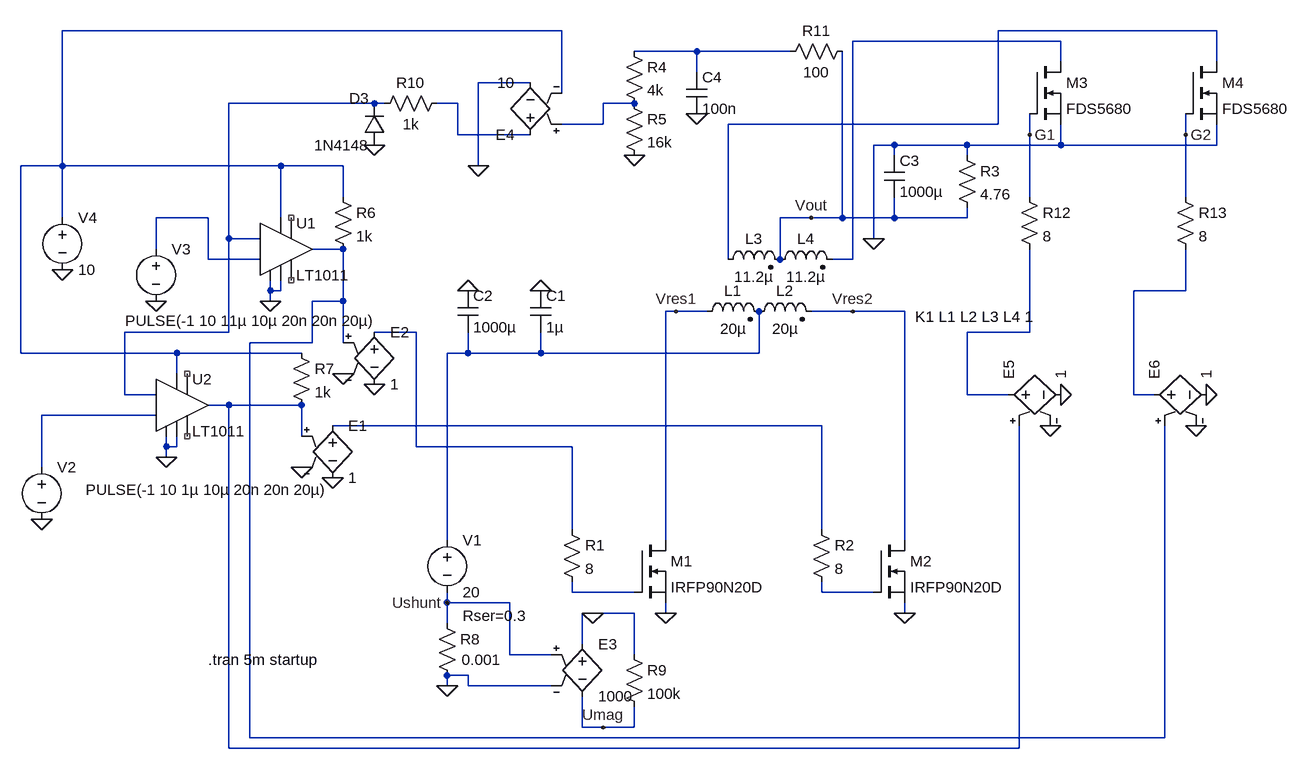
[diagram p0: schematic switcher_new_diodes2.asc]
switcher_new_diodes2.asc, the LTspice schematic file:
Version 4
SHEET 1 1648 680
WIRE 16 -640 -752 -640
WIRE 1024 -640 688 -640
WIRE 784 -624 464 -624
WIRE 224 -608 128 -608
WIRE 368 -608 224 -608
WIRE 784 -592 784 -624
WIRE 1024 -592 1024 -640
WIRE 224 -576 224 -608
WIRE -32 -560 -112 -560
WIRE 16 -544 16 -640
WIRE -272 -528 -496 -528
WIRE -256 -528 -272 -528
WIRE -144 -528 -176 -528
WIRE 128 -528 80 -528
WIRE 80 -496 80 -528
WIRE 80 -496 16 -496
WIRE 688 -496 688 -640
WIRE 688 -496 272 -496
WIRE -144 -480 -144 -528
WIRE -32 -480 -144 -480
WIRE 736 -480 736 -512
WIRE 976 -480 976 -512
WIRE 528 -464 496 -464
WIRE 640 -464 528 -464
WIRE 784 -464 784 -496
WIRE 784 -464 640 -464
WIRE 1024 -464 1024 -496
WIRE 1024 -464 784 -464
WIRE 528 -448 528 -464
WIRE 640 -448 640 -464
WIRE -752 -432 -752 -640
WIRE -752 -432 -816 -432
WIRE -416 -432 -752 -432
WIRE -320 -432 -416 -432
WIRE -112 -432 -112 -560
WIRE -320 -384 -320 -432
WIRE 736 -384 736 -480
WIRE 976 -384 976 -480
WIRE -752 -352 -752 -432
WIRE -528 -352 -608 -352
WIRE -416 -352 -416 -432
WIRE 400 -352 352 -352
WIRE 448 -352 448 -608
WIRE 448 -352 400 -352
WIRE 528 -352 528 -384
WIRE 528 -352 448 -352
WIRE 640 -352 640 -368
WIRE 640 -352 528 -352
WIRE -496 -320 -496 -528
WIRE -448 -320 -496 -320
WIRE 496 -320 496 -464
WIRE -608 -304 -608 -352
WIRE -320 -304 -368 -304
WIRE -528 -288 -528 -352
WIRE -448 -288 -528 -288
WIRE 272 -288 272 -496
WIRE 352 -288 352 -352
WIRE 464 -288 464 -624
WIRE 464 -288 432 -288
WIRE -432 -240 -432 -256
WIRE -416 -240 -416 -256
WIRE -416 -240 -432 -240
WIRE 976 -240 976 -304
WIRE 976 -240 896 -240
WIRE -432 -224 -432 -240
WIRE -320 -224 -320 -304
WIRE -320 -224 -368 -224
WIRE 192 -208 176 -208
WIRE 240 -208 192 -208
WIRE 464 -208 400 -208
WIRE 544 -208 464 -208
WIRE -496 -176 -496 -320
WIRE -496 -176 -656 -176
WIRE -208 -176 -272 -176
WIRE 736 -176 736 -304
WIRE 736 -176 640 -176
WIRE -368 -160 -368 -224
WIRE -368 -160 -464 -160
WIRE -320 -160 -320 -224
WIRE -816 -144 -816 -432
WIRE -576 -144 -816 -144
WIRE -384 -144 -576 -144
WIRE -128 -144 -128 -176
WIRE -128 -144 -160 -144
WIRE -16 -144 -16 -176
WIRE -16 -144 -128 -144
WIRE 320 -144 320 -208
WIRE 320 -144 -16 -144
WIRE -576 -112 -576 -144
WIRE -656 -80 -656 -176
WIRE -608 -80 -656 -80
WIRE 640 -80 640 -176
WIRE 704 -80 640 -80
WIRE 896 -80 896 -240
WIRE 928 -80 896 -80
WIRE -496 -64 -528 -64
WIRE -384 -64 -496 -64
WIRE -608 -48 -784 -48
WIRE 416 -32 -336 -32
WIRE -384 -16 -384 -64
WIRE -592 0 -592 -16
WIRE -576 0 -576 -16
WIRE -576 0 -592 0
WIRE -208 0 -208 -176
WIRE 32 0 -208 0
WIRE -592 16 -592 0
WIRE -784 32 -784 -48
WIRE 32 128 32 0
WIRE 416 128 416 -32
WIRE -160 144 -160 -144
WIRE 176 144 176 -208
WIRE 544 144 544 -208
WIRE 32 224 32 208
WIRE 128 224 32 224
WIRE 416 224 416 208
WIRE 496 224 416 224
WIRE -160 240 -160 224
WIRE -64 240 -160 240
WIRE 64 256 48 256
WIRE 128 256 64 256
WIRE 176 256 176 240
WIRE 544 256 544 240
WIRE -160 272 -160 240
WIRE 48 304 48 256
WIRE -64 320 -64 240
WIRE 0 320 -64 320
WIRE 128 320 128 256
WIRE -128 352 -160 352
WIRE -160 368 -160 352
WIRE -128 368 -128 352
WIRE 0 368 -128 368
WIRE 48 432 48 384
WIRE 80 432 48 432
WIRE 128 432 128 400
WIRE 128 432 80 432
WIRE -464 448 -464 -160
WIRE 944 448 944 -32
WIRE 944 448 -464 448
WIRE -496 464 -496 -64
WIRE 720 464 720 -32
WIRE 720 464 -496 464
FLAG 192 -208 Vres1
FLAG 464 -208 Vres2
FLAG -784 112 0
FLAG 496 -320 0
FLAG -16 -240 0
FLAG -128 -240 0
FLAG -608 -224 0
FLAG -432 -224 0
FLAG -752 -272 0
FLAG -592 16 0
FLAG 128 -448 0
FLAG -336 48 0
FLAG -384 32 0
FLAG -272 -96 0
FLAG -320 -112 0
FLAG -160 368 0
FLAG -160 240 Ushunt
FLAG 64 256 0
FLAG 80 432 Umag
FLAG -112 -432 0
FLAG -272 -464 0
FLAG 224 -512 0
FLAG 176 256 0
FLAG 544 256 0
FLAG 736 -480 G1
FLAG 976 -480 G2
FLAG 400 -352 Vout
FLAG 1008 -80 0
FLAG 784 -80 0
FLAG 768 -32 0
FLAG 992 -32 0
SYMBOL nmos 128 144 R0
SYMATTR InstName M1
SYMATTR Value IRFP90N20D
SYMBOL nmos 496 144 R0
SYMATTR InstName M2
SYMATTR Value IRFP90N20D
SYMBOL voltage -160 128 R0
WINDOW 123 0 0 Left 0
WINDOW 39 24 132 Left 0
SYMATTR SpiceLine Rser=0.3
SYMATTR InstName V1
SYMATTR Value 20
SYMBOL res 16 112 R0
SYMATTR InstName R1
SYMATTR Value 8
SYMBOL res 400 112 R0
SYMATTR InstName R2
SYMATTR Value 8
SYMBOL ind2 224 -192 R270
WINDOW 0 32 56 VTop 0
WINDOW 3 5 56 VBottom 0
SYMATTR InstName L1
SYMATTR Value 20µ
SYMATTR Type ind
SYMATTR SpiceLine Rser=0.1
SYMBOL ind2 304 -192 R270
WINDOW 0 32 56 VTop 0
WINDOW 3 5 56 VBottom 0
SYMATTR InstName L2
SYMATTR Value 20µ
SYMATTR Type ind
SYMATTR SpiceLine Rser=0.1
SYMBOL ind2 256 -272 R270
WINDOW 0 32 56 VTop 0
WINDOW 3 5 56 VBottom 0
SYMATTR InstName L3
SYMATTR Value 11.2µ
SYMATTR Type ind
SYMATTR SpiceLine Rser=0.01
SYMBOL voltage -784 16 R0
WINDOW 3 68 50 Left 0
WINDOW 123 0 0 Left 0
WINDOW 39 0 0 Left 0
SYMATTR Value PULSE(-1 10 1µ 10µ 20n 20n 20µ)
SYMATTR InstName V2
SYMBOL ind2 336 -272 R270
WINDOW 0 32 56 VTop 0
WINDOW 3 5 56 VBottom 0
SYMATTR InstName L4
SYMATTR Value 11.2µ
SYMATTR Type ind
SYMATTR SpiceLine Rser=0.01
SYMBOL cap 512 -448 R0
SYMATTR InstName C3
SYMATTR Value 1000µ
SYMATTR SpiceLine Rser=0.03
SYMBOL res 624 -464 R0
SYMATTR InstName R3
SYMATTR Value 4.76
SYMBOL cap -32 -240 R0
SYMATTR InstName C1
SYMATTR Value 1µ
SYMATTR SpiceLine Rser=0.001 Lser=10n
SYMBOL cap -144 -240 R0
SYMATTR InstName C2
SYMATTR Value 1000µ
SYMATTR SpiceLine Rser=0.03
SYMBOL voltage -608 -320 R0
WINDOW 3 -47 126 Left 0
WINDOW 123 0 0 Left 0
WINDOW 39 0 0 Left 0
SYMATTR Value PULSE(-1 10 11µ 10µ 20n 20n 20µ)
SYMATTR InstName V3
SYMBOL Comparators\\LT1011 -416 -304 R0
SYMATTR InstName U1
SYMBOL voltage -752 -368 R0
WINDOW 123 0 0 Left 0
WINDOW 39 0 0 Left 0
SYMATTR InstName V4
SYMATTR Value 10
SYMBOL Comparators\\LT1011 -576 -64 R0
SYMATTR InstName U2
SYMBOL res 112 -624 R0
SYMATTR InstName R4
SYMATTR Value 4k
SYMBOL res 112 -544 R0
SYMATTR InstName R5
SYMATTR Value 16k
SYMBOL e -336 -48 R0
SYMATTR InstName E1
SYMATTR Value 1
SYMBOL e -272 -192 R0
SYMATTR InstName E2
SYMATTR Value 1
SYMBOL res -336 -400 R0
SYMATTR InstName R6
SYMATTR Value 1k
SYMBOL res -400 -160 R0
SYMATTR InstName R7
SYMATTR Value 1k
SYMBOL res -176 256 R0
WINDOW 3 38 72 Left 0
SYMATTR Value 0.001
SYMATTR InstName R8
SYMBOL e 48 288 R0
SYMATTR InstName E3
SYMATTR Value 1000
SYMBOL res 112 304 R0
SYMATTR InstName R9
SYMATTR Value 100k
SYMBOL e -32 -464 R180
SYMATTR InstName E4
SYMATTR Value 10
SYMBOL diode -256 -464 R180
WINDOW 0 24 72 Left 0
WINDOW 3 24 0 Left 0
SYMATTR InstName D3
SYMATTR Value 1N4148
SYMBOL res -160 -544 R90
WINDOW 0 0 56 VBottom 0
WINDOW 3 32 56 VTop 0
SYMATTR InstName R10
SYMATTR Value 1k
SYMBOL cap 208 -576 R0
SYMATTR InstName C4
SYMATTR Value 100n
SYMATTR SpiceLine Rser=0.001 Lser=10n
SYMBOL res 464 -624 R90
WINDOW 0 0 56 VBottom 0
WINDOW 3 32 56 VTop 0
SYMATTR InstName R11
SYMATTR Value 100
SYMBOL nmos 736 -592 R0
SYMATTR InstName M3
SYMATTR Value FDS5680
SYMBOL nmos 976 -592 R0
SYMATTR InstName M4
SYMATTR Value FDS5680
SYMBOL e 688 -80 R270
SYMATTR InstName E5
SYMATTR Value 1
SYMBOL e 912 -80 R270
SYMATTR InstName E6
SYMATTR Value 1
SYMBOL res 720 -400 R0
SYMATTR InstName R12
SYMATTR Value 8
SYMBOL res 960 -400 R0
SYMATTR InstName R13
SYMATTR Value 8
TEXT 560 -200 Left 0 !K1 L1 L2 L3 L4 1
TEXT -528 328 Left 0 !.tran 5m startup

The netlist it stands for:
* switcher_new_diodes2.asc
M1 Vres1 N017 0 0 IRFP90N20D
M2 Vres2 N018 0 0 IRFP90N20D
V1 N013 Ushunt 20 Rser=0.3
R1 N011 N017 8
R2 N016 N018 8
L1 Vres1 N013 20µ Rser=0.1
L2 N013 Vres2 20µ Rser=0.1
L3 N002 Vout 11.2µ Rser=0.01
V2 N015 0 PULSE(-1 10 1µ 10µ 20n 20n 20µ)
L4 Vout N003 11.2µ Rser=0.01
C3 0 Vout 1000µ Rser=0.03
R3 0 Vout 4.76
C1 0 N013 1µ Rser=0.001 Lser=10n
C2 0 N013 1000µ Rser=0.03
V3 N008 0 PULSE(-1 10 11µ 10µ 20n 20n 20µ)
XU1 0 N008 N005 0 NC_01 NC_02 N009 N001 LT1011
V4 N001 0 10
XU2 0 N015 N005 0 NC_03 NC_04 N014 N001 LT1011
R4 N004 N007 4k
R5 N007 0 16k
E1 N016 0 N014 0 1
E2 N011 0 N009 0 1
R6 N001 N009 1k
R7 N001 N014 1k
R8 Ushunt 0 0.001
E3 0 Umag Ushunt 0 1000
R9 0 Umag 100k
E4 N006 0 N007 N001 10
D3 0 N005 1N4148
R10 N006 N005 1k
C4 N004 0 100n Rser=0.001 Lser=10n
R11 Vout N004 100
M3 N003 G1 0 0 FDS5680
M4 N002 G2 0 0 FDS5680
E5 N012 0 N014 0 1
E6 N010 0 N009 0 1
R12 G1 N012 8
R13 G2 N010 8
.model D D
.lib standard.dio
.model NMOS NMOS
.model PMOS PMOS
.lib standard.mos
K1 L1 L2 L3 L4 1
.tran 5m startup
.lib LTC1.lib
.backanno
.end